# Altium schematic sheet FPGA_Power_SPI.SchDoc: FPGA_PWR_SPI_V2
size A4; Date: 2019/08/25; CheckedBy: A Kadis; Author: DM Dong, YC Wang; CompanyName: CMMPE; DrawnBy: Daoming Dong, Youchao Wang; Revision: A; SheetNumber: 4; SheetTotal: 4
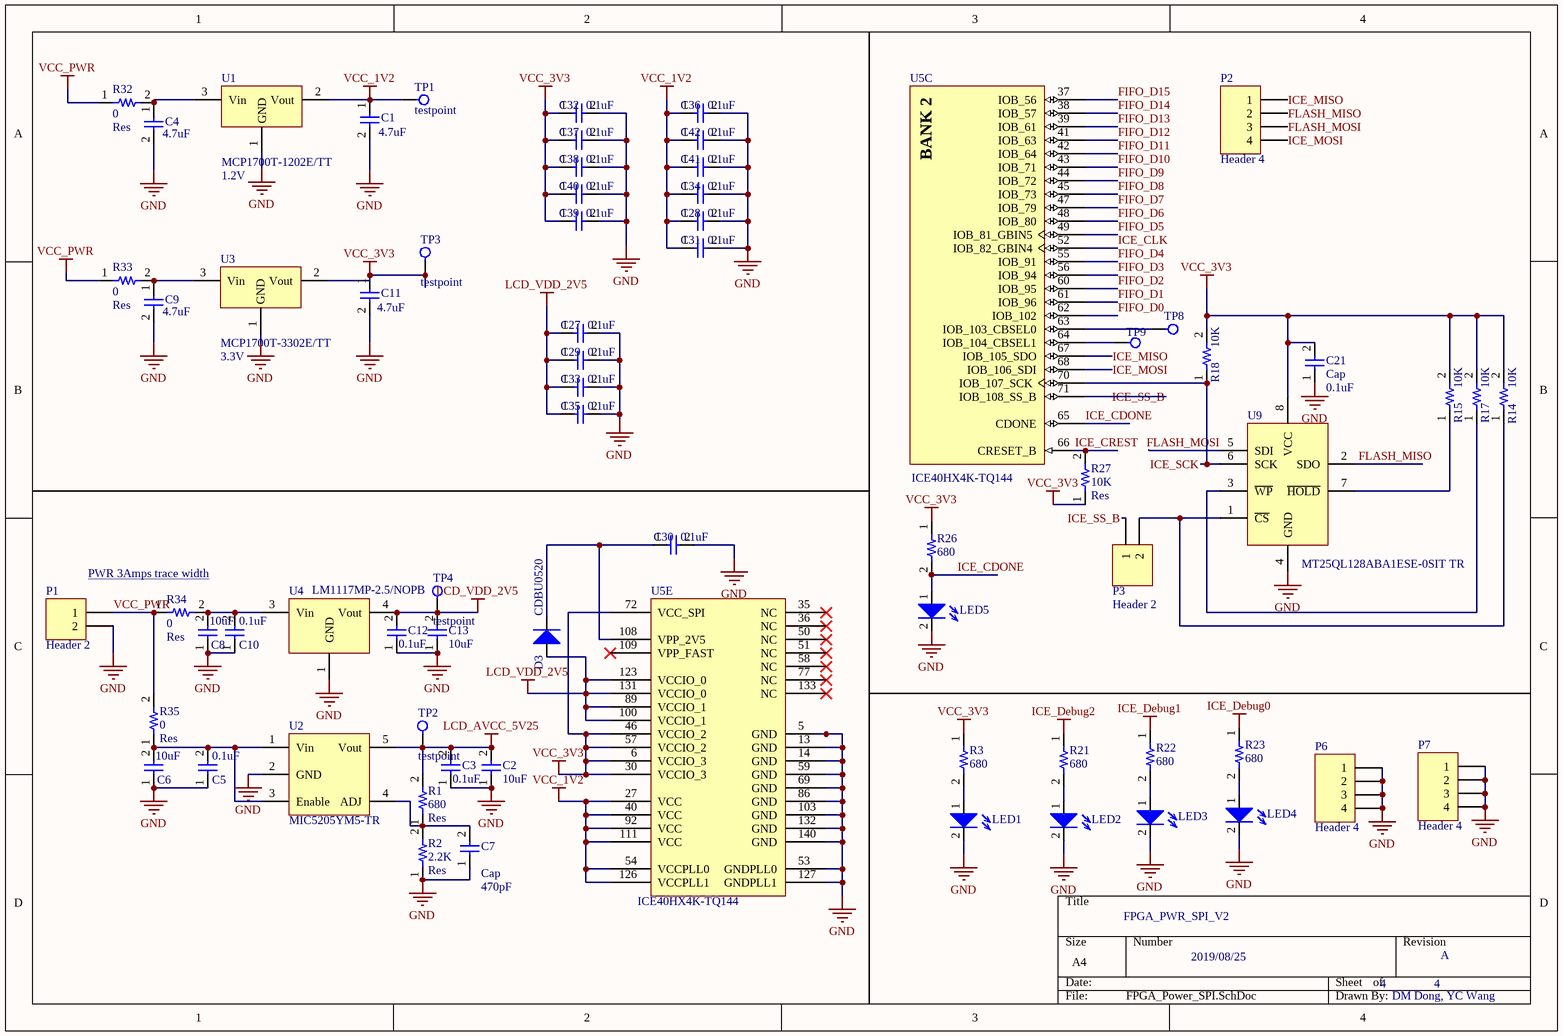
[diagram p0: FPGA_Power_SPI.SchDoc]

## Parts
C1  value 4.7uF  [Cap_4.7uF]  (hidden comment: C0603C475K9PAC7411)
C2  value 10uF  [Cap_10uF]  (hidden comment: C1608X5R0J106K080AE)
C3  value 0.1uF  [Cap_0.1uF]  (hidden comment: AC0603KRX7R9BB104)
C4  value 4.7uF  [Cap_4.7uF]  (hidden comment: C0603C475K9PAC7411)
C5  value 0.1uF  [Cap_0.1uF]  (hidden comment: AC0603KRX7R9BB104)
C6  value 10uF  [Cap_10uF]  (hidden comment: C1608X5R0J106K080AE)
C7  value 470pF  Component Name: Cap  [CAP_470pF]  (hidden comment: C0402S471K3RACAUTO)
C8  value 10uF  [Cap_10uF]  (hidden comment: C1608X5R0J106K080AE)
C9  value 4.7uF  [Cap_4.7uF]  (hidden comment: C0603C475K9PAC7411)
C10  value 0.1uF  [Cap_0.1uF]  (hidden comment: AC0603KRX7R9BB104)
C11  value 4.7uF  [Cap_4.7uF]  (hidden comment: C0603C475K9PAC7411)
C12  value 0.1uF  [Cap_0.1uF]  (hidden comment: AC0603KRX7R9BB104)
C13  value 10uF  [Cap_10uF]  (hidden comment: C1608X5R0J106K080AE)
C21  value 0.1uF  Component Name: Cap  [Cap_0.1uF]  (hidden comment: AC0603KRX7R9BB104)
C27  value 0.1uF  [Cap_0.1uF]  (hidden comment: AC0603KRX7R9BB104)
C28  value 0.1uF  [Cap_0.1uF]  (hidden comment: AC0603KRX7R9BB104)
C29  value 0.1uF  [Cap_0.1uF]  (hidden comment: AC0603KRX7R9BB104)
C30  value 0.1uF  [Cap_0.1uF]  (hidden comment: AC0603KRX7R9BB104)
C31  value 0.1uF  [Cap_0.1uF]  (hidden comment: AC0603KRX7R9BB104)
C32  value 0.1uF  [Cap_0.1uF]  (hidden comment: AC0603KRX7R9BB104)
C33  value 0.1uF  [Cap_0.1uF]  (hidden comment: AC0603KRX7R9BB104)
C34  value 0.1uF  [Cap_0.1uF]  (hidden comment: AC0603KRX7R9BB104)
C35  value 0.1uF  [Cap_0.1uF]  (hidden comment: AC0603KRX7R9BB104)
C36  value 0.1uF  [Cap_0.1uF]  (hidden comment: AC0603KRX7R9BB104)
C37  value 0.1uF  [Cap_0.1uF]  (hidden comment: AC0603KRX7R9BB104)
C38  value 0.1uF  [Cap_0.1uF]  (hidden comment: AC0603KRX7R9BB104)
C39  value 0.1uF  [Cap_0.1uF]  (hidden comment: AC0603KRX7R9BB104)
C40  value 0.1uF  [Cap_0.1uF]  (hidden comment: AC0603KRX7R9BB104)
C41  value 0.1uF  [Cap_0.1uF]  (hidden comment: AC0603KRX7R9BB104)
C42  value 0.1uF  [Cap_0.1uF]  (hidden comment: AC0603KRX7R9BB104)
D3  CDBU0520  [SchottkyDiode_CDBU0520]
LED1  TLMS1000-GS08  [LED_RED]  (value not drawn)
LED2  TLMS1000-GS08  [LED_RED]  (value not drawn)
LED3  TLMS1000-GS08  [LED_RED]  (value not drawn)
LED4  TLMS1000-GS08  [LED_RED]  (value not drawn)
LED5  TLMS1000-GS08  [LED_RED]  (value not drawn)
P1  Header 2  [HDR1X2]
P2  Header 4  [HDR2X2]
P3  Header 2  [HDR1X2]
P6  Header 4  [HDR2X2]
P7  Header 4  [HDR2X2]
R1  value 680  Component Name: Res  [RES_680]  (hidden comment: RT0603FRE13680RL)
R2  value 2.2K  Component Name: Res  [RES_2.2K]  (hidden comment: CRCW06032K20JNEAC)
R3  value 680  [RES_680]  (hidden comment: RT0603FRE13680RL)
R14  value 10K  [RES_10K]  (hidden comment: RT0603WRE0710KL)
R15  value 10K  [RES_10K]  (hidden comment: RT0603WRE0710KL)
R17  value 10K  [RES_10K]  (hidden comment: RT0603WRE0710KL)
R18  value 10K  [RES_10K]  (hidden comment: RT0603WRE0710KL)
R21  value 680  [RES_680]  (hidden comment: RT0603FRE13680RL)
R22  value 680  [RES_680]  (hidden comment: RT0603FRE13680RL)
R23  value 680  [RES_680]  (hidden comment: RT0603FRE13680RL)
R26  value 680  [RES_680]  (hidden comment: RT0603FRE13680RL)
R27  value 10K  Component Name: Res  [RES_10K]  (hidden comment: RT0603WRE0710KL)
R32  value 0  Component Name: Res  [RES_0]  (hidden comment: CRCW06030000Z0EAC)
R33  value 0  Component Name: Res  [RES_0]  (hidden comment: CRCW06030000Z0EAC)
R34  value 0  Component Name: Res  [RES_0]  (hidden comment: CRCW06030000Z0EAC)
R35  value 0  Component Name: Res  [RES_0]  (hidden comment: CRCW06030000Z0EAC)
TP1  testpoint  [testpoint]
TP2  testpoint  [testpoint]
TP3  testpoint  [testpoint]
TP4  testpoint  [testpoint]
TP8  Testpoint  [testpoint]  (value not drawn)
TP9  Testpoint  [testpoint]  (value not drawn)
U1  MCP1700T-1202E/TT  value 1.2V  [MIC_LDO_1V2]
U2  MIC5205YM5-TR  [MIC5205YM5]
U3  MCP1700T-3302E/TT  value 3.3V  [MIC_LDO_3V3]
U4  LM1117MP-2.5/NOPB  [LM1117MP-2.5/NOPB]
U5  ICE40HX4K-TQ144  [LATC-TQFP-144_L]  (parts C,E of 5)
U9  MT25QL128ABA1ESE-0SIT TR  [Flash]

## Nets
GND: C1.2 C2.1 C3.1 C4.2 C5.1 C6.1 C7.1 C8.1 C9.2 C10.1 C11.2 C12.1 C13.1 C21.1 C27.2 C28.2 C29.2 C30.2 C31.2 C32.2 C33.2 C34.2 C35.2 C36.2 C37.2 C38.2 C39.2 C40.2 C41.2 C42.2 LED1.2(Cathode) LED2.2(Cathode) LED3.2(Cathode) LED4.2(Cathode) LED5.2(Cathode) P1.2 P6.1 P6.2 P6.3 P6.4 P7.1 P7.2 P7.3 P7.4 R2.1 U1.1(GND) U2.2(GND) U3.1(GND) U4.1(GND) U5.5(GND) U5.13(GND) U5.14(GND) U5.53(GNDPLL0) U5.59(GND) U5.69(GND) U5.86(GND) U5.103(GND) U5.127(GNDPLL1) U5.132(GND) U5.140(GND) U9.4(GND)
ICE_Debug0: R23.1
ICE_Debug1: R22.1
ICE_Debug2: R21.1
LCD_AVCC_5V25: C2.2 C3.2 R1.2 TP2.1 U2.5(Vout)
LCD_VDD_2V5: C12.2 C13.2 C27.1 C29.1 C33.1 C35.1 D3.1(Anode) TP4.1 U4.4(Vout) U5.89(VCCIO_1) U5.100(VCCIO_1) U5.123(VCCIO_0) U5.131(VCCIO_0)
VCC_1V2: C1.1 C28.1 C31.1 C34.1 C36.1 C41.1 C42.1 TP1.1 U1.2(Vout) U5.27(VCC) U5.40(VCC) U5.54(VCCPLL0) U5.92(VCC) U5.111(VCC) U5.126(VCCPLL1)
VCC_3V3: C11.1 C21.2 C32.1 C37.1 C38.1 C39.1 C40.1 R3.1 R14.2 R15.2 R17.2 R18.2 R26.1 R27.1 TP3.1 U3.2(Vout) U5.6(VCCIO_3) U5.30(VCCIO_3) U5.46(VCCIO_2) U5.57(VCCIO_2) U5.72(VCC_SPI) U9.8(VCC)
VCC_PWR: P1.1 R32.1 R33.1 R34.1 R35.2
FIFO_D0: U5.62(IOB_102)
FIFO_D1: U5.61(IOB_96)
FIFO_D2: U5.60(IOB_95)
FIFO_D3: U5.56(IOB_94)
FIFO_D4: U5.55(IOB_91)
FIFO_D5: U5.49(IOB_81_GBIN5)
FIFO_D6: U5.48(IOB_80)
FIFO_D7: U5.47(IOB_79)
FIFO_D8: U5.45(IOB_73)
FIFO_D9: U5.44(IOB_72)
FIFO_D10: U5.43(IOB_71)
FIFO_D11: U5.42(IOB_64)
FIFO_D12: U5.41(IOB_63)
FIFO_D13: U5.39(IOB_61)
FIFO_D14: U5.38(IOB_57)
FIFO_D15: U5.37(IOB_56)
FLASH_MISO: P2.2 U9.2(SDO)
FLASH_MOSI: P2.3 U9.5(SDI)
ICE_CDONE: LED5.1(Anode) R26.2 U5.65(CDONE)
ICE_CLK: U5.52(IOB_82_GBIN4)
ICE_CREST: R27.2 U5.66(CRESET_B)
ICE_MISO: P2.1 U5.67(IOB_105_SDO)
ICE_MOSI: P2.4 U5.68(IOB_106_SDI)
ICE_SCK: R18.1 U5.70(IOB_107_SCK) U9.6(SCK)
ICE_SS_B: P3.1 U5.71(IOB_108_SS_B)
NetC4_1: C4.1 R32.2 U1.3(Vin)
NetC5_2: C5.2 C6.2 R35.1 U2.1(Vin) U2.3(Enable)
NetC7_2: C7.2 R1.1 R2.2 U2.4(ADJ)
NetC8_2: C8.2 C10.2 R34.2 U4.3(Vin)
NetC9_1: C9.1 R33.2 U3.3(Vin)
NetC30_1: C30.1 D3.2(Cathode) U5.108(VPP_2V5)
NetLED1_1: LED1.1(Anode) R3.2
NetLED2_1: LED2.1(Anode) R21.2
NetLED3_1: LED3.1(Anode) R22.2
NetLED4_1: LED4.1(Anode) R23.2
NetP3_2: P3.2 R14.1 U9.1(~{CS})
NetR15_1: R15.1 U9.7(~{HOLD})
NetR17_1: R17.1 U9.3(~{WP})
NetTP8_1: TP8.1 U5.63(IOB_103_CBSEL0)
NetTP9_1: TP9.1 U5.64(IOB_104_CBSEL1)

Not connected (* = marked no-connect by the designer): U5 35(NC)* 36(NC)* 50(NC)* 51(NC)* 58(NC)* 77(NC)* 109(VPP_FAST)* 133(NC)*

## Notes on the sheet
- PWR 3Amps trace width <https://www.4pcb.com/trace-width-calculator.html>
- (in symbol ICE40HX4K-TQ144, part C) BANK 2

## Library data of the parts
C1 C4 C9 C11 = Cap_4.7uF: Multilayer Ceramic Capacitors MLCC - SMD/SMT 6.3V 4.7uF 0603 X5R 10%; Manufacture No.: C0603C475K9P7411; Component Name: Cap; Created By: Daoming Dong; Date Created: 01-Mar-2019; Mouser No.: 80-C0603C475K9P7411; Package: 0603; Datasheet URL.: https://www.mouser.co.uk/datasheet/2/212/KEM_C1006_X5R_SMD-1103249.pdf
C2 C6 C8 C13 = Cap_10uF: Multilayer Ceramic Capacitors MLCC - SMD/SMT 0603 6.3V 10uF X5R 10% Soft Term; Name: Cap; Created By: Daoming Dong; Date Created: 01-Mar-2019; Mouser No.: 810-C1608X5R0J106KE; Manufacture No.: C1608X5R0J106K080AE; Datasheet URL.: https://www.mouser.co.uk/datasheet/2/400/lcc_commercial_soft_en-520032.pdf; Package: 0603
C3 C5 C10 C12 C27-C42 = Cap_0.1uF: Multilayer Ceramic Capacitors MLCC - SMD/SMT 0.1uF 10% 50V AEC-Q200; Component Name: Cap; Date Created: 01-Mar-2019; Created By: Daoming Dong; Datasheet URL: https://www.mouser.co.uk/datasheet/2/447/UPY-AC_NP0X7R_16V-to-630V_11-1511105.pdf; Package: 0603; Manufacture No.: AC0603KRX7R9BB104; Mouser No.: 603-AC0603KR9BB104
C7 = Cap_470pF: Multilayer Ceramic Capacitors MLCC - SMD/SMT 25V 470pF X7R 0402 10% AEC-Q200; Manufacture: KEMET; Date Created: 13-Mar-2019; Created By: Daoming Dong; Manufacture No.: C0402S471K3RACAUTO; Mouser No.: 80-C0402S471K3RAUTO; Datasheet URL.: https://www.mouser.co.uk/datasheet/2/212/KEM_C1014_X7R_FE-CAP_SMD-1102761.pdf; Case Code: 0603
C21 = Cap_0.1uF: Multilayer Ceramic Capacitors MLCC - SMD/SMT 0.1uF 10% 50V AEC-Q200; Date Created: 01-Mar-2019; Created By: Daoming Dong; Datasheet URL: https://www.mouser.co.uk/datasheet/2/447/UPY-AC_NP0X7R_16V-to-630V_11-1511105.pdf; Package: 0603; Manufacture No.: AC0603KRX7R9BB104; Mouser No.: 603-AC0603KR9BB104
D3 = SDiode_CDBU0520: Schottky Diodes & Rectifiers VR=20V, IO=500mA; Manufacture: Comchip Technology; Manufacture No.: CDBU0520; Mouser No.: 750-CDBU0520; Case Code: 0603; Created By: Daoming Dong; Date Created: 03-May-2019; Datasheet URL.: https://www.mouser.co.uk/datasheet/2/80/CDBU0520-HF-RevA797161-1481024.pdf
LED1-LED5 = LED_RED: Standard LEDs - SMD RED; Component Name: LED_R; Vf: 1.8V; Created By: Daoming Dong; Date Created: 11-Mar-2018; Manufacture No.: TLMS1000-GS08; Mouser No.: 78-TLMS1000; Case Code: 0603; Datasheet URL.: https://www.mouser.co.uk/datasheet/2/427/tlmb1100-279843.pdf
P1 P3 = Header 2: Header, 2-Pin; LatestRevisionDate: 17-Jul-2002; LatestRevisionNote: Re-released for DXP Platform.; Publisher: Altium Limited
P2 P6 P7 = Header 4: Header, 4-Pin; LatestRevisionDate: 17-Jul-2002; LatestRevisionNote: Re-released for DXP Platform.; Publisher: Altium Limited
R1 = Res_680: Thin Film Resistors - SMD 680 ohm 1% 50 ppm Thin Film; Manufacture: Yageo; Manufacture No.: RT0603FRE13680RL; Mouser No.: 603-RT0603FRE13680RL; Created By: Daoming Dong; Date Created: 02-Mar-2019; Datasheet URL.: https://www.mouser.co.uk/datasheet/2/447/PYu-RT_1-to-0.01_RoHS_L_9-1222720.pdf; Case Code: 0603
R2 = Res_2.2K: Thick Film Resistors - SMD 1/10Watt 2.2Kohms 5% Commercial Use; Manufacture: Vishay; Manufacture No.: CRCW06032K20JNEAC; Mouser No.: 71-CRCW06032K20JNEAC; Created By: Daoming Dong; Date Created: 02-Mar-2019; Case Code: 0603; Datasheet URL.: https://www.mouser.co.uk/datasheet/2/427/crcwce3-1223726.pdf
R3 R21-R23 R26 = Res_680: Thin Film Resistors - SMD 680 ohm 1% 50 ppm Thin Film; Manufacture: Yageo; Component Name: Res; Manufacture No.: RT0603FRE13680RL; Mouser No.: 603-RT0603FRE13680RL; Created By: Daoming Dong; Date Created: 02-Mar-2019; Datasheet URL.: https://www.mouser.co.uk/datasheet/2/447/PYu-RT_1-to-0.01_RoHS_L_9-1222720.pdf; Case Code: 0603
R14 R15 R17 R18 = Res_10K: Thin Film Resistors - SMD 10K ohm 0.05% 50 ppm High-Precision; Manufacture: Yageo; Component Name: Res; Manufacture No.: RT0603WRE0710KL; Mouser No.: 603-RT0603WRE0710KL; Created By: Daoming Dong; Date Created: 02-Mar-2019; Datasheet URL.: https://www.mouser.co.uk/datasheet/2/447/PYu-RT_1-to-0.01_RoHS_L_9-1222720.pdf; Case Code: 0603
R27 = Res_10K: Thin Film Resistors - SMD 10K ohm 0.05% 50 ppm High-Precision; Manufacture: Yageo; Manufacture No.: RT0603WRE0710KL; Mouser No.: 603-RT0603WRE0710KL; Created By: Daoming Dong; Date Created: 02-Mar-2019; Datasheet URL.: https://www.mouser.co.uk/datasheet/2/447/PYu-RT_1-to-0.01_RoHS_L_9-1222720.pdf; Case Code: 0603
R32-R35 = Res_0: Thick Film Resistors - SMD 1/10Watt 0ohms Commercial Use; Manufacture: Vishay; Case Code: 0603; Manufacture No.: CRCW06030000Z0EAC; Mouser No.: 71-CRCW06030000Z0EAC; Created By: Daoming Dong; Date Created: 02-Mar-2019; Datasheet URL.: https://www.mouser.co.uk/datasheet/2/427/crcwce3-1223726.pdf
TP1-TP4 TP8 TP9 = Testpoint: Testpoint for testing voltage; Created By: Daoming Dong; Date Created: 11-Mar-2019
U1 = MIC_LDO_1V2: LDO Voltage Regulators 250mA Adj LDO 2%; Manufacture: Microchip; Component Name: LDO 1.2V; Created By: Daoming Dong; Date Created: 13-Mar-2019; Manufacture No.: MCP1700T-1202E/TT; Mouser No.: 579-MCP1700T1202E/TT; Datasheet URL.: https://www.mouser.co.uk/datasheet/2/268/MCP1700-Low-Quiescent-Current-LDO-20001826E-737536.pdf
U2 = MIC5205YM5: LDO Voltage Regulators 150mA 1% Low Noise LDO; Manufacture: Microchip Technology; Manufacture No.: MIC5205YM5-TR; Mouser No.: 998-MIC5205YM5TR; Datasheet URL.: https://www.mouser.co.uk/datasheet/2/268/mic5205-778789.pdf; Created By: Daoming Dong; Date Created: 11-Mar-2019
U3 = MIC_LDO_3V3: 3.3v LDO Voltage Regulators 250mA Adj LDO 2%; Manufacture: Microchip; Manufacture No.: MCP1700T-3302E/TT; Mouser No.: 579-MCP1700T3302E/TT; Date Created: 14-Mar-2019; Created By: Daoming Dong; Datasheet URL.: https://www.mouser.co.uk/datasheet/2/268/MCP1700-Low-Quiescent-Current-LDO-20001826E-737536.pdf; Component Name: LDO
U4 = LDO_2V5: LDO Voltage Regulators 800mA LDO Linear Reg; Manufacture: Texas Instruments; Manufacture No.: LM1117MP-2.5/NOPB; Mouser No.: 926-LM1117MP-2.5/NOPB; Created By: Daoming Dong; Date Created: 05-Mar-2019; Datasheet URL.: http://www.ti.com/general/docs/suppproductinfo.tsp?distId=26&gotoUrl=http%3A%2F%2Fwww.ti.com%2Flit%2Fds%2Fsymlink%2Flm1117.pdf
U5 = ICE40HX4K-TQ144: iCE40 HX4K Series FPGA Family, 3520 Logic Cells, 1.2 V Core, 80 K Embedded RAM Bits, 144-pin TQFP, Pb-Free, Tray; Manufacturer: Lattice Semiconductor; Embedded RAM Bits: 80K; Logic Cells: 3520; Phase-Locked Loops: 2; Supply Voltage: 1.2V; DatasheetVersion: Rev. 02.9; PackageVersion: Rev. 03.9, 02/2013; PackageReference: TQFP-144; PackageDescription: 144-Pin Thin Quad Flat Package, Body 20 x 20 mm, Pitch 0.5 mm; Supplier 1: Digi-Key; Supplier Part Number 1: 220-1572-ND; Supplier 2: Mouser; Supplier Part Number 2: 842-ICE40HX4K-TQ144; Packing: Tray; RoHS: TRUE; Mounting Technology: Surface Mount; PartNumber: ICE40HX4K-TQ144; ComponentLink1Description: Manufacturer URL; ComponentLink1URL: http://www.latticesemi.com/en; ComponentLink2Description: Datasheet; ComponentLink2URL: http://www.latticesemi.com/~/media/Documents/DataSheets/iCE/iCE40LPHXFamilyDataSheet.pdf; ComponentLink3Description: Package Specification; ComponentLink3URL: http://www.latticesemi.com/lit/docs/package/pkg.pdf
U9 = Flash: NOR Flash SPI FLASH NOR SLC 32MX4 SOIC; Manufacture: Micron; Created By: Daoming Dong; Date Created: 05-Mar-2019; Mouser No.: 340-224871-REEL; Manufacture No.: MT25QL128ABA1ESE-0SIT TR; Datasheet URL.: https://www.mouser.co.uk/datasheet/2/671/MT25Q_QLHS_L_128_ABA_0-1287003.pdf